# EAGLE design hybrid_lower_pcb3_1 (EAGLE 8.4.1)

## Sheet 1 of 8: micro,xbee,sd
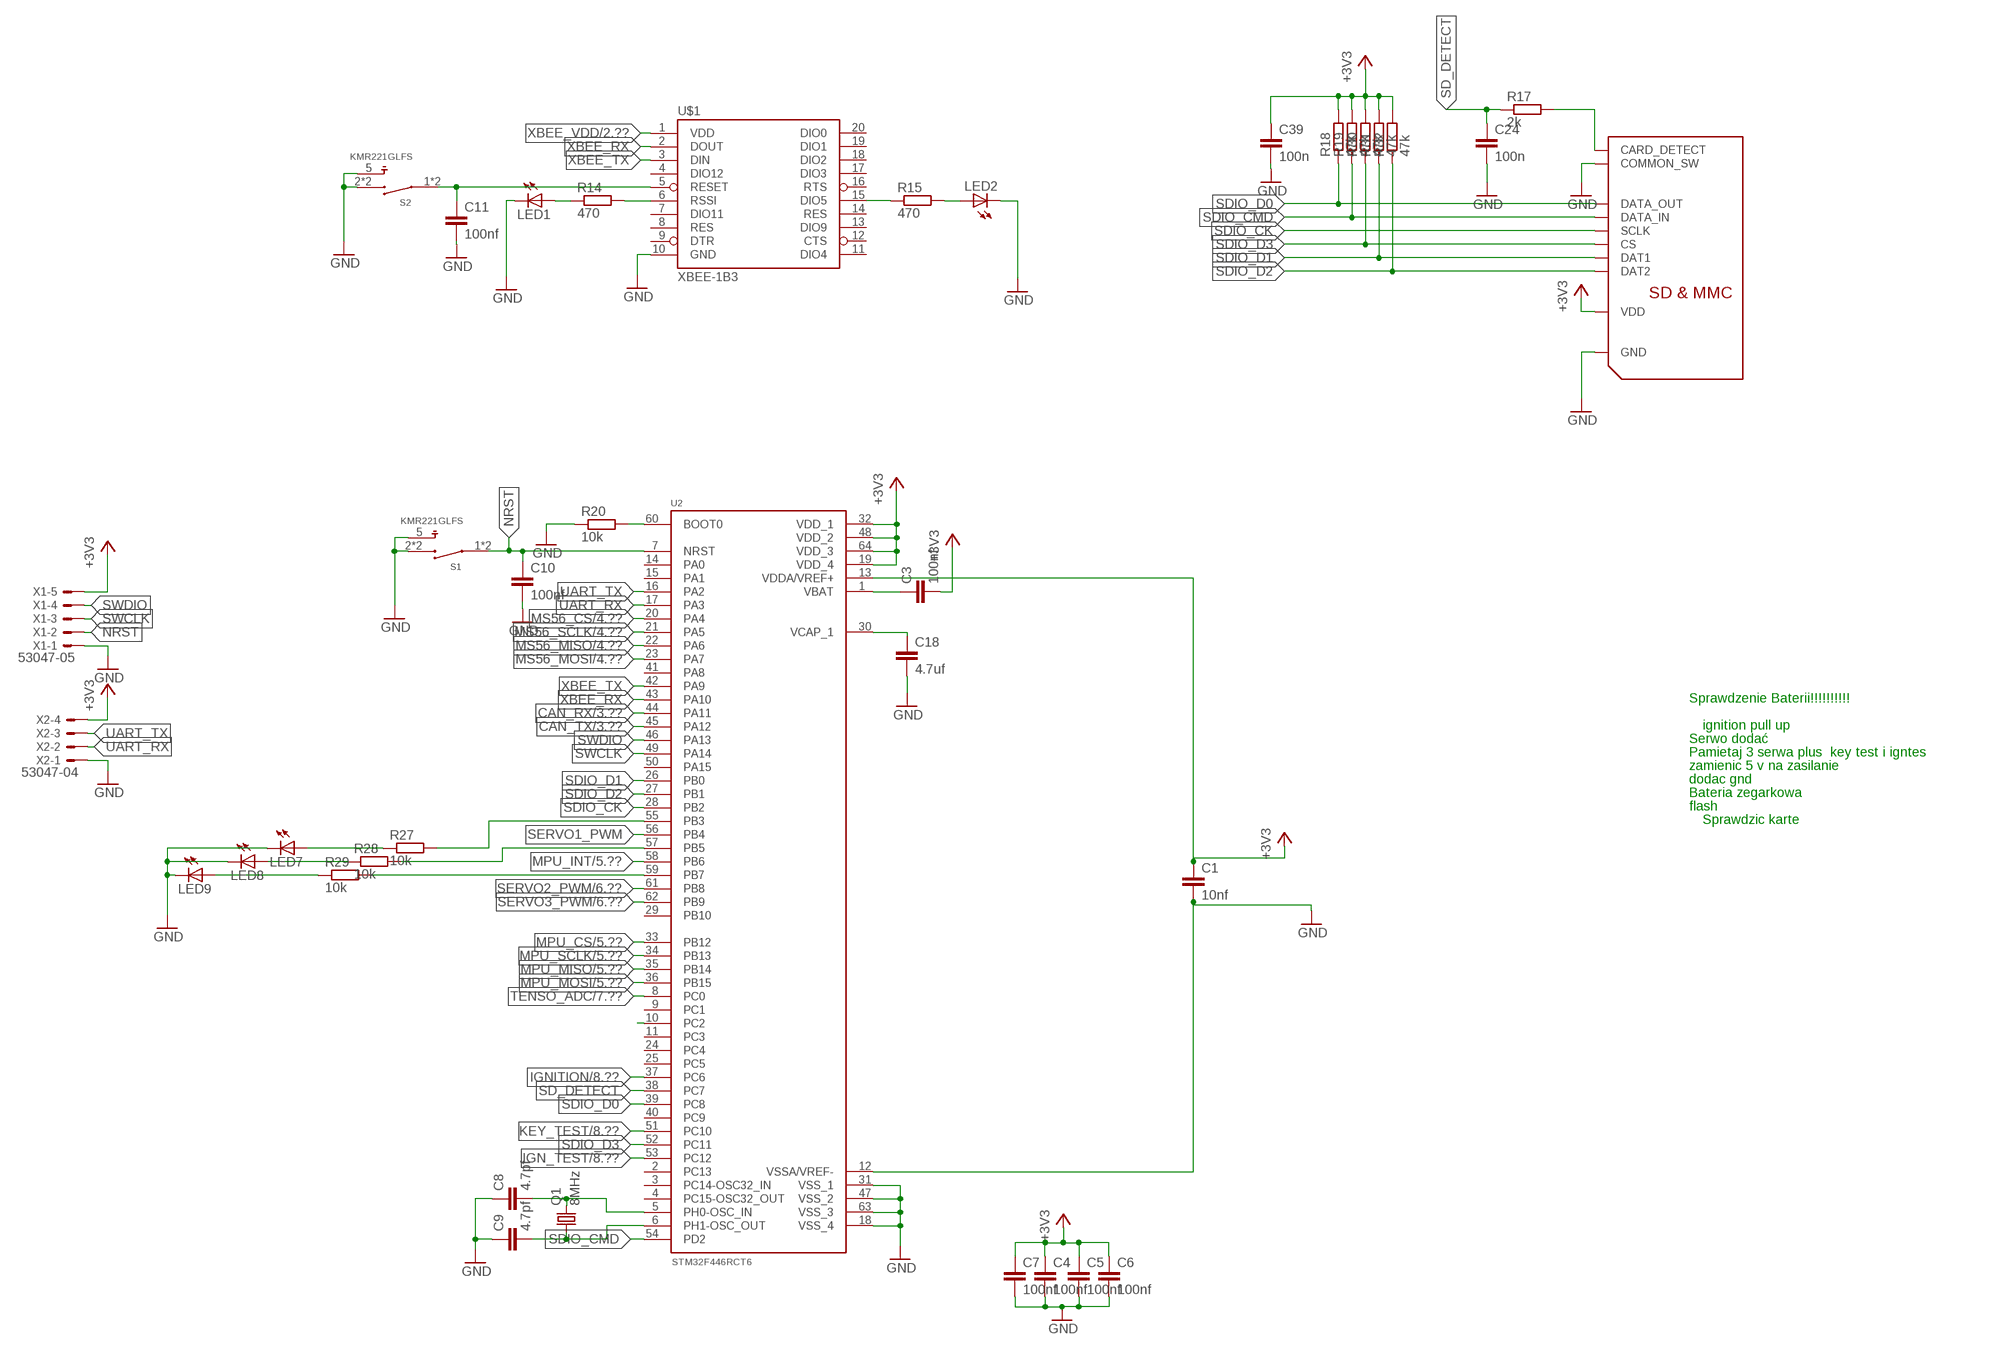
[diagram p0: schematic, sheet 1]

### Parts
C1  10nf  C-EUC0603  [C0603]
C3  100nf  C-EUC0603  [C0603]
C4  100nf  C-EUC0603  [C0603]
C5  100nf  C-EUC0603  [C0603]
C6  100nf  C-EUC0603  [C0603]
C7  100nf  C-EUC0603  [C0603]
C8  4.7pf  C-EUC0603  [C0603]
C9  4.7pf  C-EUC0603  [C0603]
C10  100nf  C-EUC0603  [C0603]
C11  100nf  C-EUC0603  [C0603]
C18  4.7uf  C-EUC0805  [C0805]
C24  100n  C-EUC0603K  [C0603K]
C39  100n  C-EUC0603K  [C0603K]
LED1  LED0603  [LED-0603]
LED2  LED0603  [LED-0603]
LED7  LED0603  [LED-0603]
LED8  LED0603  [LED-0603]
LED9  LED0603  [LED-0603]
Q1  8MHz  CRYSTALCTS406  [CTS406]
R14  470  R-EU_R0603  [R0603]
R15  470  R-EU_R0603  [R0603]
R17  2k  R-EU_R0603  [R0603]
R18  47k  R-EU_R0603  [R0603]
R19  47k  R-EU_R0603  [R0603]
R20  10k  R-EU_R0603  [R0603]
R27  10k  R-EU_R0603  [R0603]
R28  10k  R-EU_R0603  [R0603]
R29  10k  R-EU_R0603  [R0603]
R30  47k  R-EU_R0603  [R0603]
R31  47k  R-EU_R0603  [R0603]
R32  47k  R-EU_R0603  [R0603]
S1  KMR221GLFS  [SW_KMR221GLFS]
S2  KMR221GLFS  [SW_KMR221GLFS]
U2  STM32F446RCT6  [QFP50P1200X1200X160-64N]
U$1  XBEE-1B3  [XBEE-SMD]
U$11  MOLEX_MICRO_SD_503182-1853  [MOLEX_MICRO_SD_503182-1853]
X1  53047-05  [53047-05]
X2  53047-04  [53047-04]

### Nets
+3V3: C1.1 C3.2 C4.1 C5.1 C6.1 C7.1 C39.1 R18.2 R19.2 R30.2 R31.2 R32.2 U2.13(VDDA/VREF+) U2.19(VDD_4) U2.32(VDD_1) U2.48(VDD_2) U2.64(VDD_3) U$11.PIN4(VDD) X1.5 X2.4 ; also sheet 2,3,4,5,8
CAN_RX: U2.44(PA11) ; also sheet 3
CAN_TX: U2.45(PA12) ; also sheet 3
DUPA: C11.1 S2.1 S2.4 U$1.5(RESET)
GND: C1.2 C4.2 C5.2 C6.2 C7.2 C8.1 C9.1 C10.2 C11.2 C18.2 C24.2 C39.2 LED1.C LED2.C LED7.C LED8.C LED9.C R20.1 S1.2 S1.3 S1.5 S2.2 S2.3 S2.5 U2.12(VSSA/VREF-) U2.18(VSS_4) U2.31(VSS_1) U2.47(VSS_2) U2.63(VSS_3) U$1.10(GND) U$11.DETECT_GND(COMMON_SW) U$11.PIN6(GND) X1.1 X2.1 ; also sheet 2,3,4,5,6,7,8
IGN_TEST: U2.53(PC12) ; also sheet 8
IGNITION: U2.37(PC6) ; also sheet 8
KEY_TEST: U2.51(PC10) ; also sheet 8
MPU_CS: U2.33(PB12) ; also sheet 5
MPU_INT: U2.58(PB6) ; also sheet 5
MPU_MISO: U2.35(PB14) ; also sheet 5
MPU_MOSI: U2.36(PB15) ; also sheet 5
MPU_SCLK: U2.34(PB13) ; also sheet 5
MS56_CS: U2.20(PA4) ; also sheet 4
MS56_MISO: U2.22(PA6) ; also sheet 4
MS56_MOSI: U2.23(PA7) ; also sheet 4
MS56_SCLK: U2.21(PA5) ; also sheet 4
N$2: C18.1 U2.30(VCAP_1)
N$6: C3.1 U2.1(VBAT)
N$7: LED1.A R14.1
N$8: C8.2 Q1.3 U2.5(PH0-OSC_IN)
N$9: C9.2 Q1.1 U2.6(PH1-OSC_OUT)
N$11: LED2.A R15.2
N$18: R14.2 U$1.6(RSSI)
N$19: R15.1 U$1.15(DIO5)
N$29: R20.2 U2.60(BOOT0)
N$30: R27.2 U2.55(PB3)
N$33: R28.2 U2.57(PB5)
N$34: R29.2 U2.59(PB7)
N$36: LED7.A R27.1
N$37: LED8.A R28.1
N$38: LED9.A R29.1
N$41: U2.10(PC2)
N$42: R17.2 U$11.DETECT(CARD_DETECT)
NRST: C10.1 S1.1 S1.4 U2.7(NRST) X1.2
SD_DETECT: C24.1 R17.1 U2.38(PC7)
SDIO_CK: U2.28(PB2) U$11.PIN5(SCLK)
SDIO_CMD: R19.1 U2.54(PD2) U$11.PIN3(DATA_IN)
SDIO_D0: R18.1 U2.39(PC8) U$11.PIN7(DATA_OUT)
SDIO_D1: R31.1 U2.26(PB0) U$11.PIN8(DAT1)
SDIO_D2: R32.1 U2.27(PB1) U$11.PIN1(DAT2)
SDIO_D3: R30.1 U2.52(PC11) U$11.PIN2(CS)
SERVO1_PWM: U2.56(PB4)
SERVO2_PWM: U2.61(PB8) ; also sheet 6
SERVO3_PWM: U2.62(PB9) ; also sheet 6
SWCLK: U2.49(PA14) X1.3
SWDIO: U2.46(PA13) X1.4
TENSO_ADC: U2.8(PC0) ; also sheet 7
UART_RX: U2.17(PA3) X2.2
UART_TX: U2.16(PA2) X2.3
XBEE_RX: U2.43(PA10) U$1.2(DOUT)
XBEE_TX: U2.42(PA9) U$1.3(DIN)
XBEE_VDD: U$1.1(VDD) ; also sheet 2
Unconnected: U2.2(PC13) U2.3(PC14-OSC32_IN) U2.4(PC15-OSC32_OUT) U2.9(PC1) U2.11(PC3) U2.14(PA0) U2.15(PA1) U2.24(PC4) U2.25(PC5) U2.29(PB10) U2.40(PC9) U2.41(PA8) U2.50(PA15) U$1.4(DIO12) U$1.7(DIO11) U$1.8(RES) U$1.9(DTR) U$1.11(DIO4) U$1.12(CTS) U$1.13(DIO9) U$1.14(RES) U$1.16(RTS) U$1.17(DIO3) U$1.18(DIO2) U$1.19(DIO1) U$1.20(DIO0)

### Notes on the sheet
- Sprawdzenie Baterii!!!!!!!!!!
- ignition pull up
- Serwo dodać
- Pamietaj 3 serwa plus  key test i igntes
- zamienic 5 v na zasilanie
- dodac gnd
- Bateria zegarkowa
- flash
- Sprawdzic karte

## Sheet 2 of 8: supply
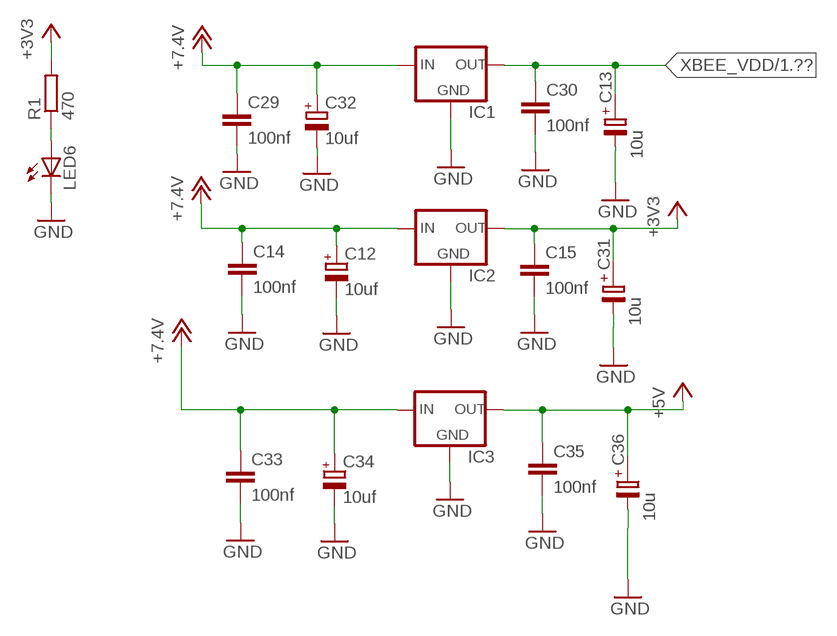
[diagram p1: schematic, sheet 2]

### Parts
C12  10uf  CPOL-EUSANYO_SMD_B6  [SANYO-OSCON_SMD_B6]
C13  10u  C-PR-SMD-TE-B  [TE-B-3528]
C14  100nf  C-EUC0603  [C0603]
C15  100nf  C-EUC0603  [C0603]
C29  100nf  C-EUC0603  [C0603]
C30  100nf  C-EUC0603  [C0603]
C31  10u  C-PR-SMD-TE-B  [TE-B-3528]
C32  10uf  CPOL-EUSANYO_SMD_B6  [SANYO-OSCON_SMD_B6]
C33  100nf  C-EUC0603  [C0603]
C34  10uf  CPOL-EUSANYO_SMD_B6  [SANYO-OSCON_SMD_B6]
C35  100nf  C-EUC0603  [C0603]
C36  10u  C-PR-SMD-TE-B  [TE-B-3528]
IC1  LM1117  [SOT223]
IC2  LM1117  [SOT223]
IC3  LM1117  [SOT223]
LED6  LED0603  [LED-0603]
R1  470  R-EU_R0603  [R0603]

### Nets
+3V3: C15.1 C31.+ IC2.2(OUT) R1.2 ; also sheet 1,3,4,5,8
+5V: C35.1 C36.+ IC3.2(OUT) ; also sheet 6,7
+12V: C12.+ C14.1 C29.1 C32.+ C33.1 C34.+ IC1.3(IN) IC2.3(IN) IC3.3(IN) ; supply symbol labelled +7.4V ; also sheet 6,8
GND: C12.- C13.- C14.2 C15.2 C29.2 C30.2 C31.- C32.- C33.2 C34.- C35.2 C36.- IC1.1(GND) IC2.1(GND) IC3.1(GND) LED6.C ; also sheet 1,3,4,5,6,7,8
N$28: LED6.A R1.1
XBEE_VDD: C13.+ C30.1 IC1.2(OUT) ; also sheet 1

## Sheet 3 of 8: CAN
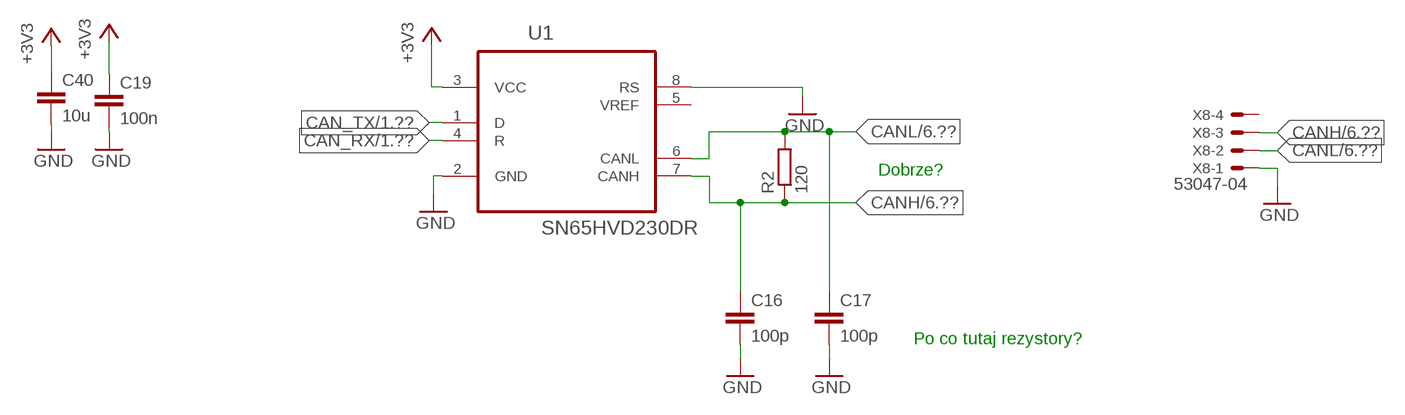
[diagram p2: schematic, sheet 3]

### Parts
C16  100p  C-EUC0603  [C0603]
C17  100p  C-EUC0603  [C0603]
C19  100n  C-EUC0603  [C0603]
C40  10u  C-EUC0805  [C0805]
R2  120  R-EU_R0603  [R0603]
U1  SN65HVD230DR  [SOIC127P600X175-8N]
X8  53047-04  [53047-04]

### Nets
+3V3: C19.1 C40.1 U1.3(VCC) ; also sheet 1,2,4,5,8
CAN_RX: U1.4(R) ; also sheet 1
CAN_TX: U1.1(D) ; also sheet 1
CANH: C16.1 R2.1 U1.7(CANH) X8.3 ; also sheet 6
CANL: C17.1 R2.2 U1.6(CANL) X8.2 ; also sheet 6
GND: C16.2 C17.2 C19.2 C40.2 U1.2(GND) U1.8(RS) X8.1 ; also sheet 1,2,4,5,6,7,8
Unconnected: U1.5(VREF) X8.4

### Notes on the sheet
- Dobrze?
- Po co tutaj rezystory?

## Sheet 4 of 8: Altimeter
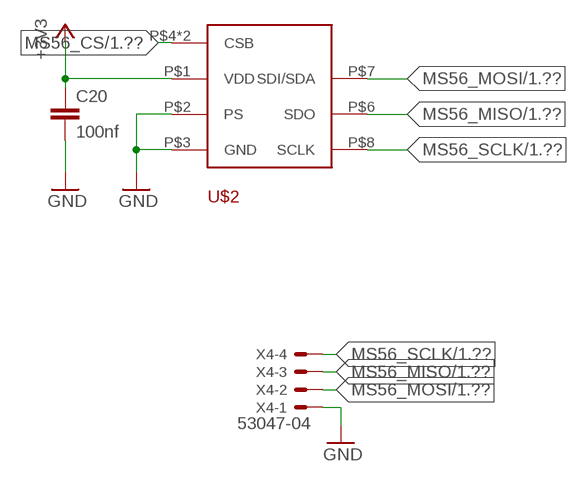
[diagram p3: schematic, sheet 4]

### Parts
C20  100nf  C-EUC0603  [C0603]
U$2  MS56XX  [MS56XX]
X4  53047-04  [53047-04]

### Nets
+3V3: C20.1 U$2.P$1(VDD) ; also sheet 1,2,3,5,8
GND: C20.2 U$2.P$2(PS) U$2.P$3(GND) X4.1 ; also sheet 1,2,3,5,6,7,8
MS56_CS: U$2.P$4(CSB) U$2.P$5(CSB) ; also sheet 1
MS56_MISO: U$2.P$6(SDO) X4.3 ; also sheet 1
MS56_MOSI: U$2.P$7(SDI/SDA) X4.2 ; also sheet 1
MS56_SCLK: U$2.P$8(SCLK) X4.4 ; also sheet 1

## Sheet 5 of 8: MPU-9250
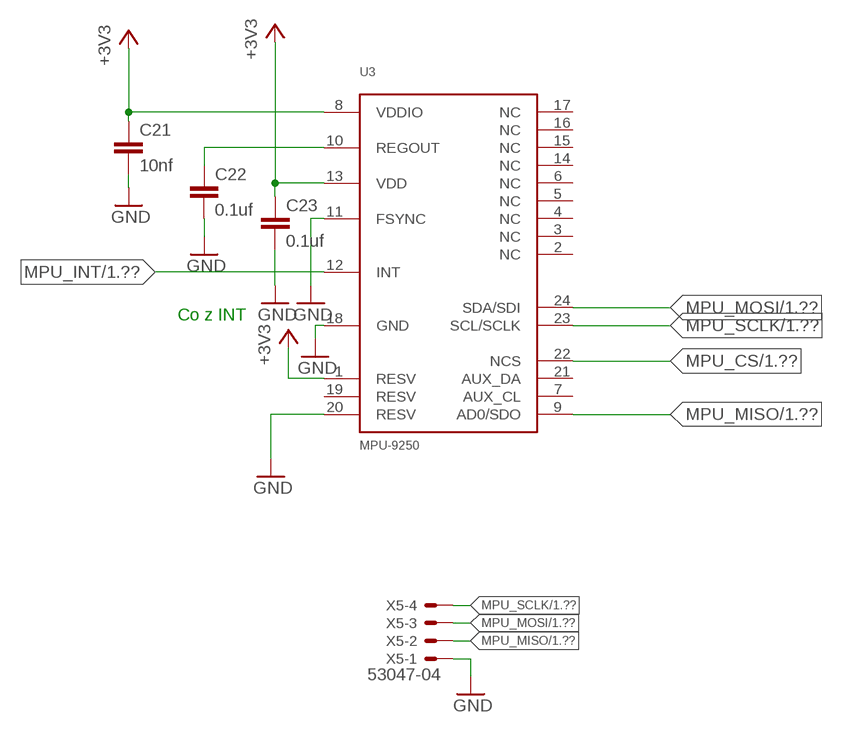
[diagram p4: schematic, sheet 5]

### Parts
C21  10nf  C-EUC0603  [C0603]
C22  0.1uf  C-EUC0603  [C0603]
C23  0.1uf  C-EUC0603  [C0603]
U3  MPU-9250  [MPU-9250]
X5  53047-04  [53047-04]

### Nets
+3V3: C21.1 C23.1 U3.1(RESV) U3.8(VDDIO) U3.13(VDD) ; also sheet 1,2,3,4,8
GND: C21.2 C22.2 C23.2 U3.11(FSYNC) U3.18(GND) U3.20(RESV) X5.1 ; also sheet 1,2,3,4,6,7,8
MPU_CS: U3.22(NCS) ; also sheet 1
MPU_INT: U3.12(INT) ; also sheet 1
MPU_MISO: U3.9(AD0/SDO) X5.2 ; also sheet 1
MPU_MOSI: U3.24(SDA/SDI) X5.3 ; also sheet 1
MPU_SCLK: U3.23(SCL/SCLK) X5.4 ; also sheet 1
N$1: C22.1 U3.10(REGOUT)
Unconnected: U3.2(NC) U3.3(NC) U3.4(NC) U3.5(NC) U3.6(NC) U3.7(AUX_CL) U3.14(NC) U3.15(NC) U3.16(NC) U3.17(NC) U3.19(RESV) U3.21(AUX_DA)

### Notes on the sheet
- Co z INT

## Sheet 6 of 8: connection
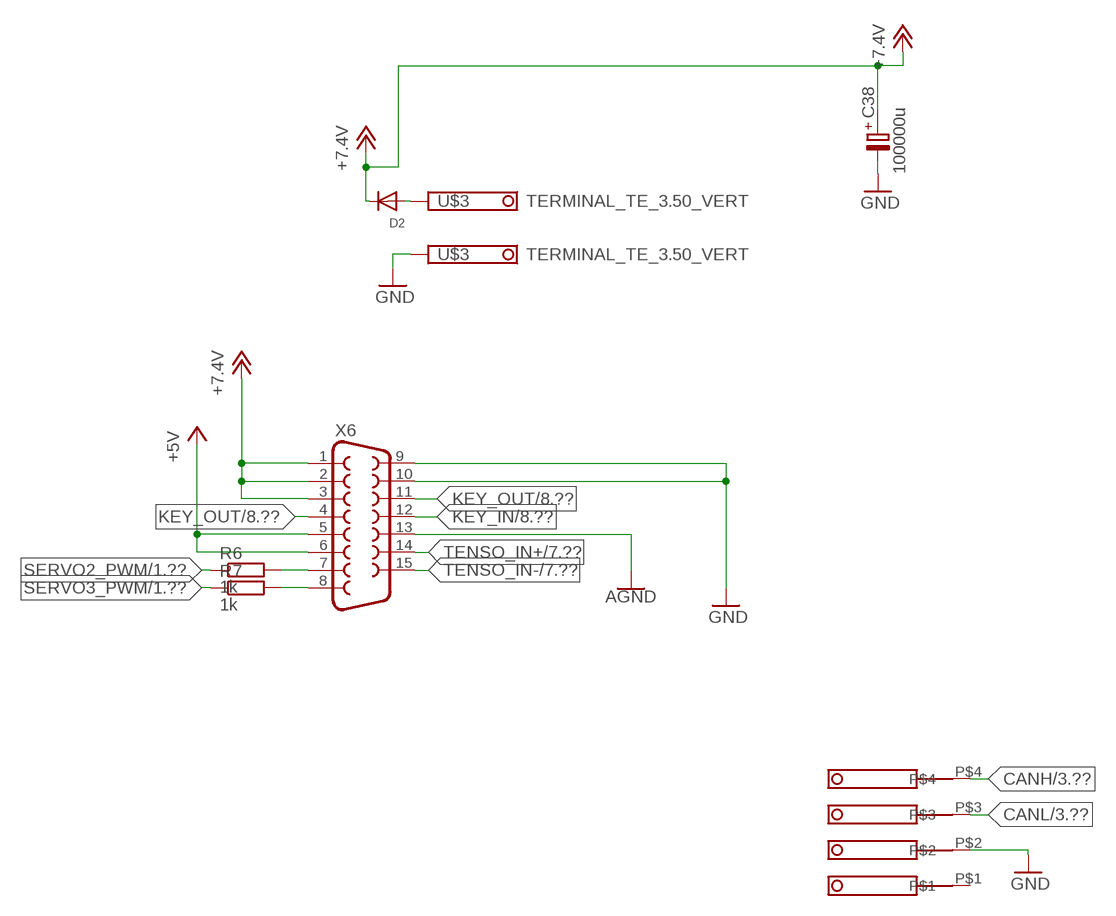
[diagram p5: schematic, sheet 6]

### Parts
C38  100000u  C-PR-SMD-TE-B  [TE-B-3528]
D2  DIODESOD-523  [SOD-523]
R6  1k  R-EU_R0603  [R0603]
R7  1k  R-EU_R0603  [R0603]
U$3  TERMINAL_TE_3.50_VERT  [TE_3.5_TERMINAL_VERT]
U$10  39505-1005  [39505-1005]
X6  F15VP  [F15VP]

### Nets
+5V: X6.5 X6.6 ; also sheet 2,7
+12V: C38.+ D2.K(C) X6.1 X6.2 X6.3 ; supply symbol labelled +7.4V ; also sheet 2,8
AGND: X6.13 ; also sheet 7
CANH: U$10.P$4 ; also sheet 3
CANL: U$10.P$3 ; also sheet 3
GND: C38.- U$3.P$2(K1) U$10.P$2 X6.9 X6.10 ; also sheet 1,2,3,4,5,7,8
KEY_IN: X6.12 ; also sheet 8
KEY_OUT: X6.4 X6.11 ; also sheet 8
N$13: R6.2 X6.7
N$14: R7.2 X6.8
N$17: D2.A U$3.P$1(K)
SERVO2_PWM: R6.1 ; also sheet 1
SERVO3_PWM: R7.1 ; also sheet 1
TENSO_IN+: X6.14 ; also sheet 7
TENSO_IN-: X6.15 ; also sheet 7
Unconnected: U$10.P$1

## Sheet 7 of 8
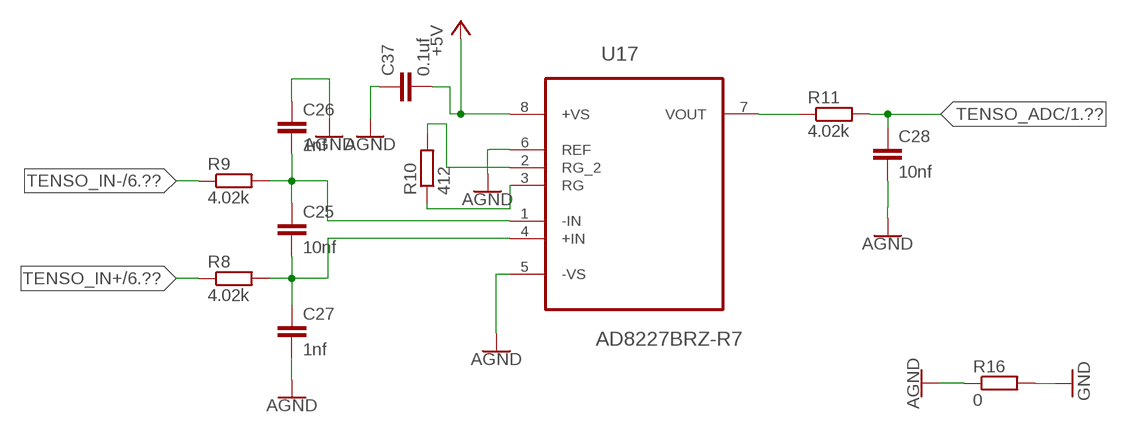
[diagram p6: schematic, sheet 7]

### Parts
C25  10nf  C-EUC0603  [C0603]
C26  1nf  C-EUC0603  [C0603]
C27  1nf  C-EUC0603  [C0603]
C28  10nf  C-EUC0603  [C0603]
C37  0.1uf  C-EUC0603  [C0603]
R8  4.02k  R-EU_R0603  [R0603]
R9  4.02k  R-EU_R0603  [R0603]
R10  412  R-EU_R0805  [R0805]
R11  4.02k  R-EU_R0603  [R0603]
R16  0  R-EU_R0603  [R0603]
U17  AD8227BRZ-R7  [SOIC127P600X175-8N]

### Nets
+5V: C37.2 U17.8(+VS) ; also sheet 2,6
AGND: C26.1 C27.2 C28.2 C37.1 R16.1 U17.5(-VS) U17.6(REF) ; also sheet 6
GND: R16.2 ; also sheet 1,2,3,4,5,6,8
N$3: C25.1 C26.2 R9.2 U17.1(-IN)
N$4: C25.2 C27.1 R8.2 U17.4(+IN)
N$10: R10.1 U17.3(RG)
N$15: R10.2 U17.2(RG_2)
N$16: R11.1 U17.7(VOUT)
TENSO_ADC: C28.1 R11.2 ; also sheet 1
TENSO_IN+: R8.1 ; also sheet 6
TENSO_IN-: R9.1 ; also sheet 6

## Sheet 8 of 8: Ignition
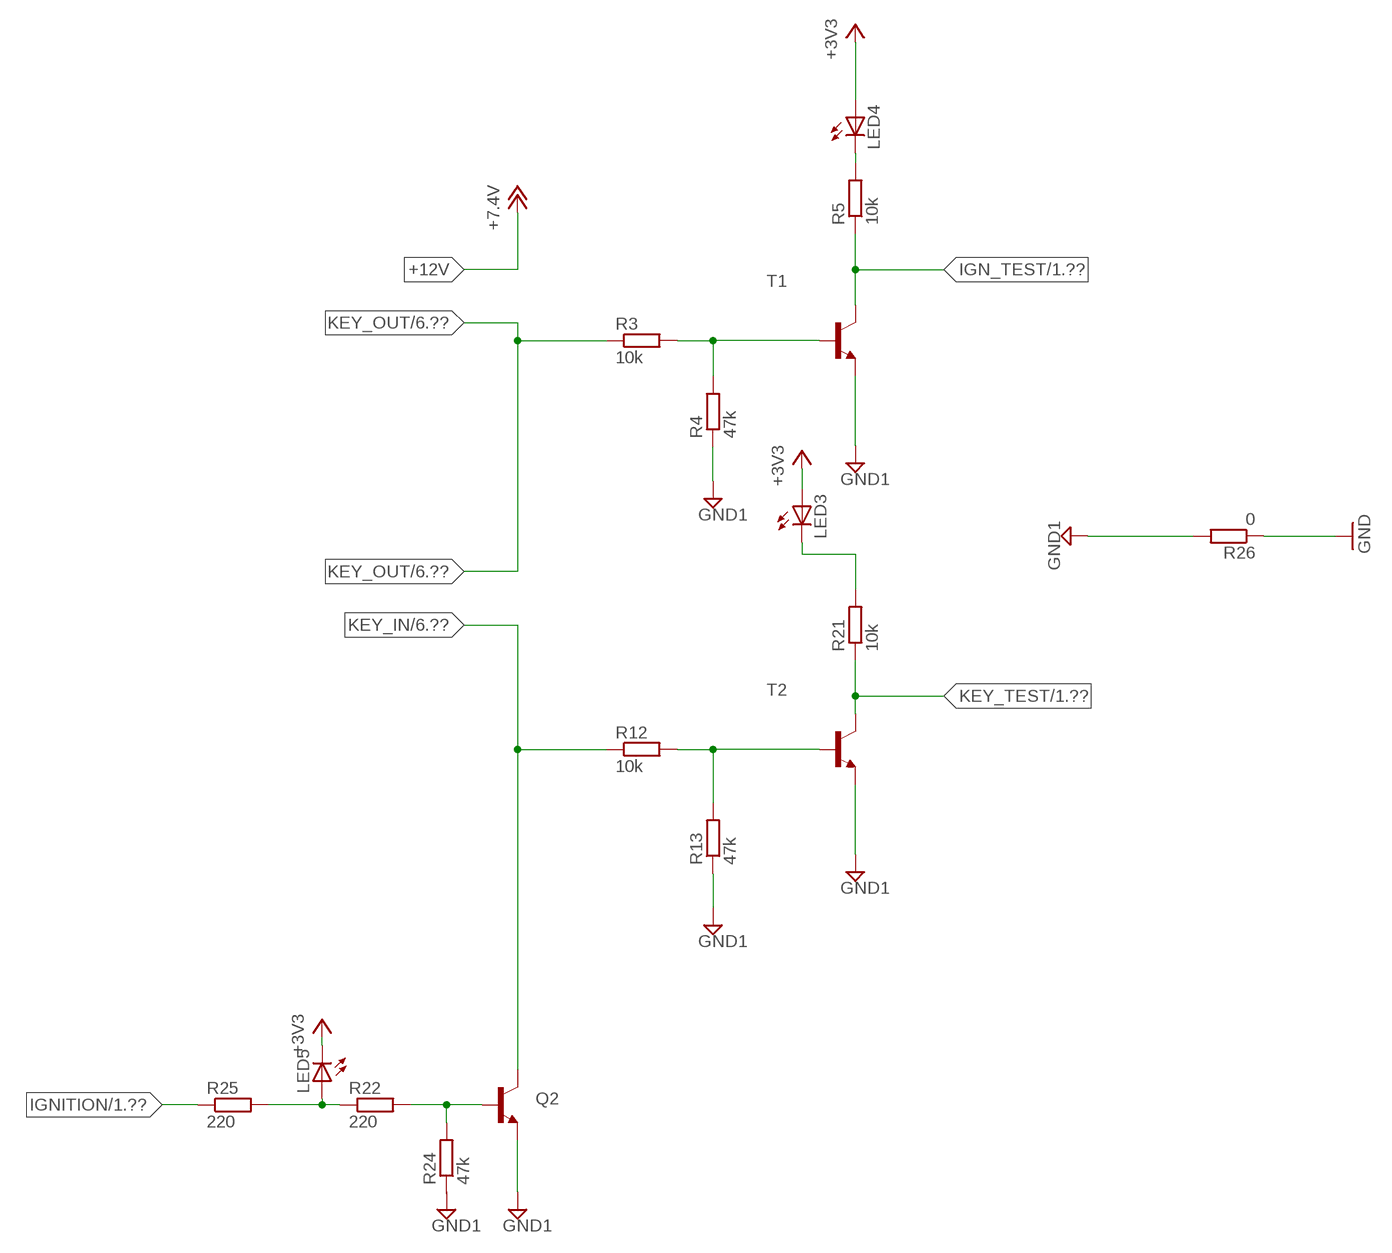
[diagram p7: schematic, sheet 8]

### Parts
LED3  LED0603  [LED-0603]
LED4  LED0603  [LED-0603]
LED5  LED0603  [LED-0603]
Q2  TRANSISTOR_NPNSOT23-3  [SOT23-3]
R3  10k  R-EU_R0603  [R0603]
R4  47k  R-EU_R0603  [R0603]
R5  10k  R-EU_R0603  [R0603]
R12  10k  R-EU_R0603  [R0603]
R13  47k  R-EU_R0603  [R0603]
R21  10k  R-EU_R0603  [R0603]
R22  220  R-EU_R0603  [R0603]
R24  47k  R-EU_R0603  [R0603]
R25  220  R-EU_R0603  [R0603]
R26  0  R-EU_R0603  [R0603]
T1  BCW81-NPN-SOT23-BEC  [SOT23-BEC]
T2  BCW81-NPN-SOT23-BEC  [SOT23-BEC]

### Nets
+3V3: LED3.A LED4.A LED5.C ; also sheet 1,2,3,4,5
GND: R26.1 ; also sheet 1,2,3,4,5,6,7
GND1: Q2.2(E) R4.1 R13.1 R26.2 T1.E T2.E
IGN_TEST: R5.1 T1.C ; also sheet 1
IGNITION: R25.1 ; also sheet 1
KEY_IN: Q2.3(C) R12.1 ; also sheet 6
KEY_OUT: R3.1 ; also sheet 6
KEY_TEST: R21.1 T2.C ; also sheet 1
N$5: R3.2 R4.2 T1.B
N$12: R12.2 R13.2 T2.B
N$20: LED4.C R5.2
N$21: LED3.C R21.2
N$31: Q2.1(B) R22.2 R24.2
N$35: LED5.A R22.1 R25.2
Unconnected: R24.1

## Library data of the parts
C1 C3-C11 C14-C17 C19 C21-C30 C33 C35 C37 C39 C40 = rcl:C-EU: CAPACITOR, European symbol
C12 C32 C34 = rcl:CPOL-EU: POLARIZED CAPACITOR, European symbol; SPICEPREFIX: C
C13 C31 C36 C38 = capacitors:C-PR: POLARIZED ELECTROLYTIC/TANTALUM
C18 = rcl:C-EU: CAPACITOR, European symbol; SPICEPREFIX: C
C20 = resistor:C-EU: CAPACITOR, European symbol
D2 = adafruit:DIODE: Diode SMADIODE - SMA Surface Mount Package 20V 1A Schottky Diode Digikey: 641-1014-6-ND DO-1N4148 - Through Hole Small Current Diode SOD-123 20V 1 A (.5mV Vf) Schottky Diode - Digikey: MBRX120TPMSCT-ND SOD-323 10V 570mA (.38mV Vf, 3ns) Schottky Diode - Digikey: ZLLS410CT-ND SOD-523 30V 30mA Schottky Diode (RB751S-40TE61) - Digikey: RB751S-40TE61CT-ND SOT23-R/W - SOT23 Package (R = Solder Paste/Reflow Ovens, W = Hand-Soldering) BAT54Film 40V 300mA - Digikey: 497-7162-1-ND
IC1-IC3 = v-reg-3:LM1117
LED1-LED9 = SparkFun:LED: LEDs Standard schematic elements and footprints for 5mm, 3mm, 1206, and 0603 sized LEDs. 5mm - Spark Fun Electronics SKU : COM-00529 (and others)
Q1 = crystal:CRYSTAL: CRYSTAL; OC_FARNELL: unknown; OC_NEWARK: unknown
Q2 = SparkFun:TRANSISTOR_NPN: Transistor NPN BJT configuration in SOT23 package. MMBT2222 is the common NPN we use. Double check BCE configuration again layout.
R1 R16 R20 R27-R29 = resistor:R-EU_: RESISTOR, European symbol
R2-R15 R17-R19 R21 R22 R24-R26 R30-R32 = rcl:R-EU_: RESISTOR, European symbol
S1 S2 = KMR221GLFS:KMR221GLFS: Switch Tactile N.O. SPST Button Gull Wing 0.05A 32VDC 1VA 200000Cycles 2N SMD Automotive T/R; AVAILABILITY: Good; DESCRIPTION: Switch Tactile N.O. SPST Button Gull Wing 0.05A 32VDC 1VA 200000Cycles 2N SMD Automotive T/R; MF: C&K Components; MP: KMR221GLFS; PACKAGE: None; PRICE: 0.28 USD
T1 T2 = DC_LOAD_AU:*-NPN-: NPN Transistror BF959 corrected 2008.03.06
U1 = SN65HVD230DR:SN65HVD230DR: 3.3-V CAN TRANSCEIVERS; AVAILABILITY: Good; DESCRIPTION: 3.3V CAN Transceiver with Standby Mode 8-SOIC -40 to 85; MF: Texas Instruments; MP: SN65HVD230DR; PACKAGE: SOIC-8 Texas Instruments; PRICE: 1.59 USD
U2 = STM32F446RCT6:STM32F446RCT6: 32 Bit Microcontroller, High Performance, ARM Cortex-M4, 180 MHz, 256 KB, 128 KB, 64, LQFP; AVAILABILITY: Good; DESCRIPTION: 32 Bit Microcontroller, High Performance, ARM Cortex-M4, 180 MHz, 256 KB, 128 KB, 64, LQFP; MF: STMicroelectronics; MP: STM32F446RCT6; PACKAGE: LQFP-64 STMicroelectronics; PRICE: 5.57 USD
U3 = MPU-9250:MPU-9250: 314990005; AVAILABILITY: Good; DESCRIPTION: SMD Gyroscope/Accelerometer/Magnetometer Sensor; 9-AXIS; MF: InvenSense; MP: MPU-9250; PACKAGE: QFN-24 InvenSense; PRICE: 6.45 USD
U17 = Analog Devices_By_element14_Batch_1:AD8227BRZ-R7: Wide Supply Range, Rail-to-Rail Output Instrumentation Amplifier; MPN: AD8227BRZ-R7; OC_FARNELL: -; OC_NEWARK: 14R8723; PACKAGE: SOIC-8; SUPPLIER: Analog Devices
U$1 = SparkFun:XBEE-1
U$2 = MS56XX:MS56XX
U$3 = Terminal_TE_3.50:TERMINAL_TE_3.50_VERT
U$10 = 39505-1005:39505-1005
U$11 = SD_Reader:MOLEX_MICRO_SD_503182-1853
X1 = con-molex:53?-05: CONNECTOR wire to board 1.25 mm (.049 inch) pitch header; MF: MOLEX; MPN: 53047-0510; OC_FARNELL: 9732861; OC_NEWARK: 38C9901
X2 X4 X5 X8 = con-molex:53?-04: CONNECTOR wire to board 1.25 mm (.049 inch) pitch header; MF: WALDOM/MOLEX; MPN: 53047-0410; OC_FARNELL: 9733060; OC_NEWARK: 38C9900
X6 = adafruit:F15: SUB-D HDH is also known as a 'right angle VGA' connector

## Board
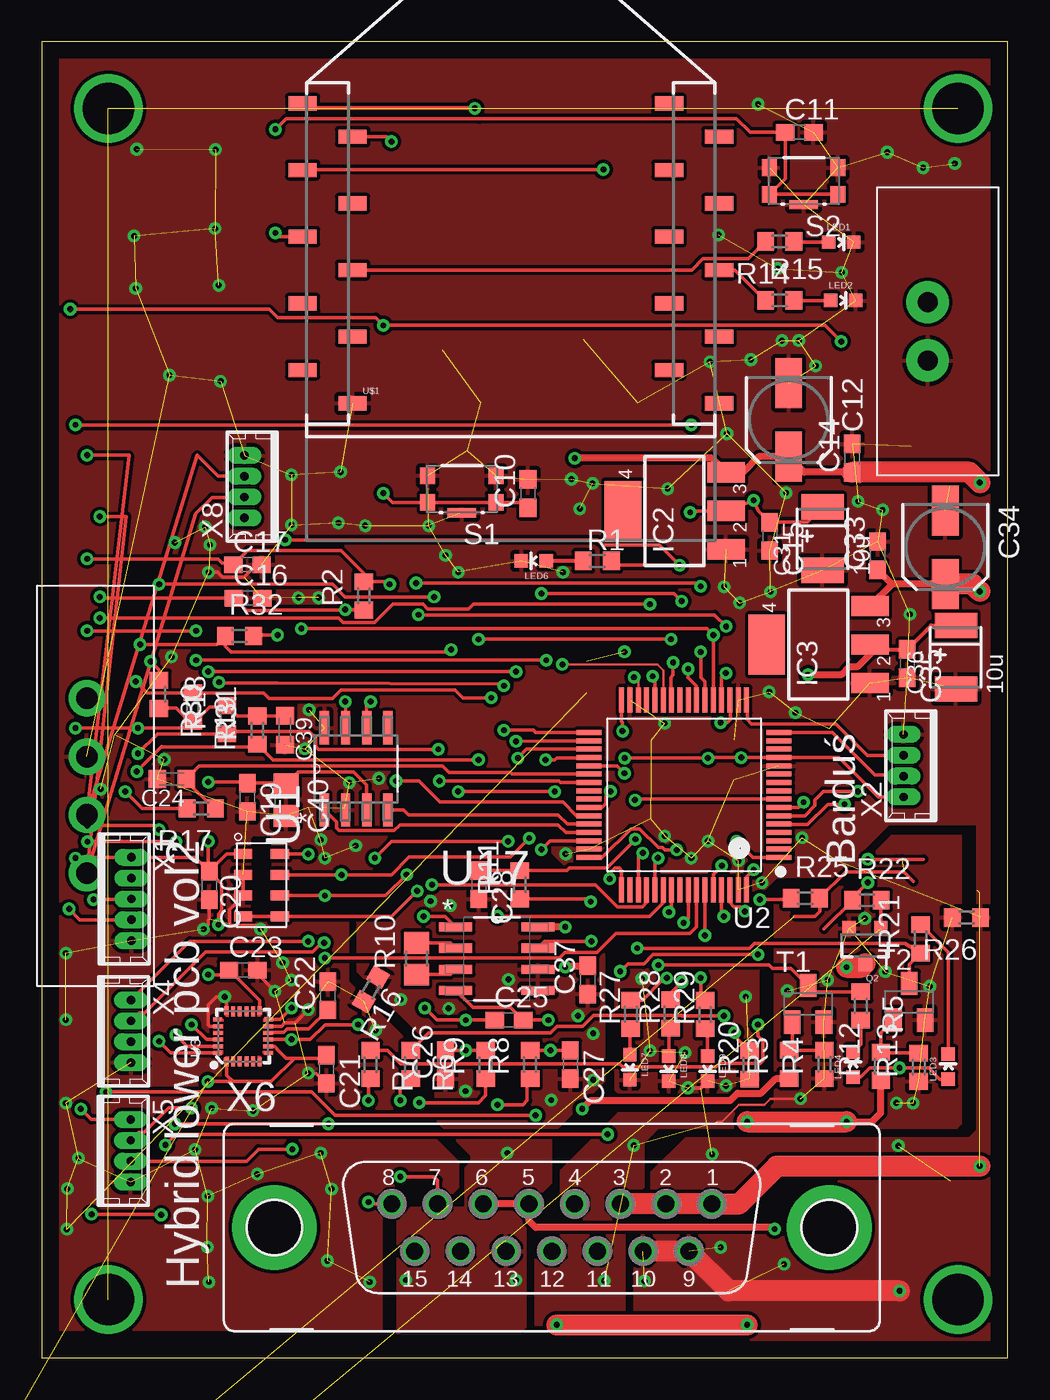
[diagram p8: board, top side]
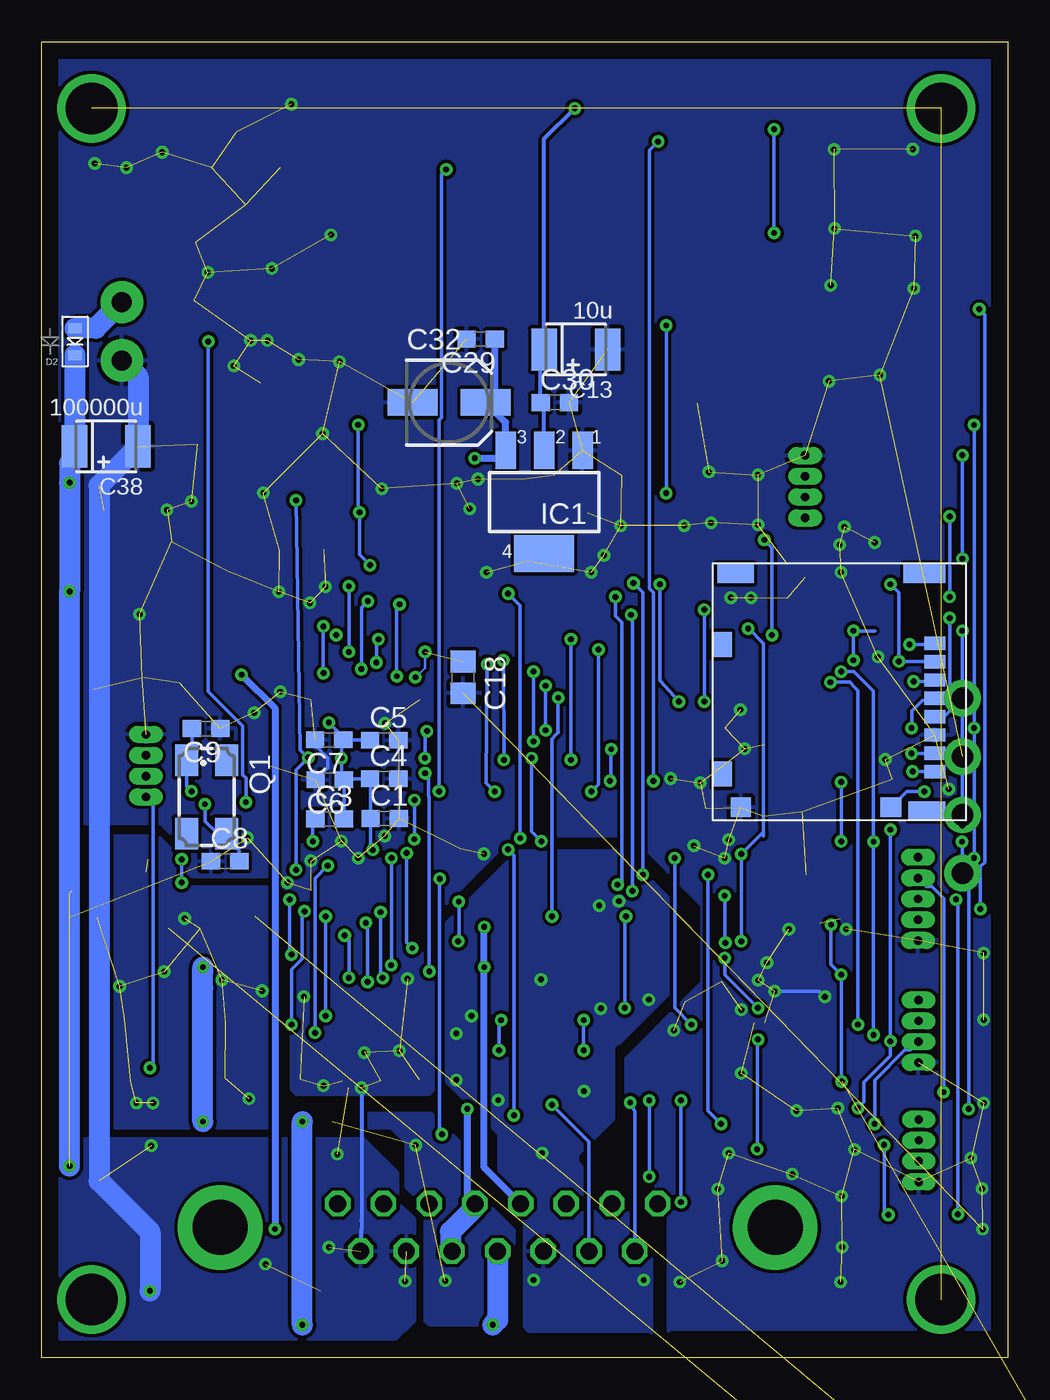
[diagram p9: board, bottom side, seen from below]

Size 58 x 79 mm. Coordinates in mm from the lower left corner, seen from the top.
Outline: 0,0 58,0 58,79 0,79 0,0
Copper layers (1*16): Top 0.035mm / dielectric 1.5mm / Bottom 0.035mm
Design rules "default *": minimum track width 6mil, minimum drill 0.35mm, track to track 6mil, track to pad 6mil, pad to pad 6mil, via to via 6mil, smd to smd 6mil, copper to edge 40mil, drill to drill 6mil, minimum pad ring 10mil, minimum via ring 8mil, stop-mask expansion 4mil, vias tented up to drill 15mil, thermal gap 10mil
tRestrict: area 12.8,27 to 13.6,31.1

### Footprints (pad centres in the part's own frame; a part is rotated, then mirrored left to right if it is on the bottom)
C0603 = smd 1.1 x 1: 1 -0.85,0; 2 0.85,0
SANYO-OSCON_SMD_B6 = smd 3 x 1.6: + 2.2,0; - -2.2,0
TE-B-3528 = smd 1.524 x 2.54: + 1.905,0; - -1.905,0
C0805 = smd 1.3 x 1.5: 1 -0.95,0; 2 0.95,0
C0603K = smd 1.05 x 1.08: 1 -0.875,0; 2 0.875,0
SOD-523 = smd 0.8 x 0.6: A 0,-0.8; K 0,0.8
SOT223 = smd 1.219 x 2.235: 1 -2.311,-3.099; 2 0,-3.099; 3 2.311,-3.099 | smd 3.6 x 2.2: 4 0,3.099
LED-0603 = smd 0.8 x 0.8: A 0,-0.75; C 0,0.75
CTS406 = smd 1.9 x 1.4: 1 -2.2,-1.2; 2 2.2,-1.2; 3 2.2,1.2; 4 -2.2,1.2
SOT23-3 = smd 0.8 x 0.9: 1 -0.95,-1; 2 0.95,-1; 3 0,1.1
R0603 = smd 1 x 1.1: 1 -0.85,0; 2 0.85,0
R0805 = smd 1.3 x 1.5: 1 -0.95,0; 2 0.95,0
SW_KMR221GLFS = smd 0.9 x 1: 1 -2.05,0.8; 2 -2.05,-0.8; 3 2.05,-0.8; 4 2.05,0.8 | smd 1.7 x 0.55: 5 0,1.425
SOT23-BEC = smd 1 x 1.4: B -0.95,-1.1; C 0,1.1; E 0.95,-1.1
SOIC127P600X175-8N = smd 1.981 x 0.559: 1 -2.464,1.905; 2 -2.464,0.635; 3 -2.464,-0.635; 4 -2.464,-1.905; 5 2.464,-1.905; 6 2.464,-0.635; 7 2.464,0.635; 8 2.464,1.905
QFP50P1200X1200X160-64N = smd 1.5 x 0.3: 1 -5.7,3.75; 2 -5.7,3.25; 3 -5.7,2.75; 4 -5.7,2.25; 5 -5.7,1.75; 6 -5.7,1.25; 7 -5.7,0.75; 8 -5.7,0.25; 9 -5.7,-0.25; 10 -5.7,-0.75; 11 -5.7,-1.25; 12 -5.7,-1.75; 13 -5.7,-2.25; 14 -5.7,-2.75; 15 -5.7,-3.25; 16 -5.7,-3.75; 33 5.7,-3.75; 34 5.7,-3.25; 35 5.7,-2.75; 36 5.7,-2.25; 37 5.7,-1.75; 38 5.7,-1.25; 39 5.7,-0.75; 40 5.7,-0.25; 41 5.7,0.25; 42 5.7,0.75; 43 5.7,1.25; 44 5.7,1.75; 45 5.7,2.25; 46 5.7,2.75; 47 5.7,3.25; 48 5.7,3.75 | smd 0.3 x 1.5: 17 -3.75,-5.7; 18 -3.25,-5.7; 19 -2.75,-5.7; 20 -2.25,-5.7; 21 -1.75,-5.7; 22 -1.25,-5.7; 23 -0.75,-5.7; 24 -0.25,-5.7; 25 0.25,-5.7; 26 0.75,-5.7; 27 1.25,-5.7; 28 1.75,-5.7; 29 2.25,-5.7; 30 2.75,-5.7; 31 3.25,-5.7; 32 3.75,-5.7; 49 3.75,5.7; 50 3.25,5.7; 51 2.75,5.7; 52 2.25,5.7; 53 1.75,5.7; 54 1.25,5.7; 55 0.75,5.7; 56 0.25,5.7; 57 -0.25,5.7; 58 -0.75,5.7; 59 -1.25,5.7; 60 -1.75,5.7; 61 -2.25,5.7; 62 -2.75,5.7; 63 -3.25,5.7; 64 -3.75,5.7
MPU-9250 = smd 0.495 x 0.25: 1 -1.552,1; 6 -1.552,-1; 13 1.552,-1; 18 1.552,1 | smd 0.6 x 0.24: 2 -1.5,0.6; 3 -1.5,0.2; 4 -1.5,-0.2; 5 -1.5,-0.6; 14 1.5,-0.6; 15 1.5,-0.2; 16 1.5,0.2; 17 1.5,0.6 | smd 0.25 x 0.495: 7 -1,-1.552; 12 1,-1.552; 19 1,1.552; 24 -1,1.552 | smd 0.24 x 0.6: 8 -0.6,-1.5; 9 -0.2,-1.5; 10 0.2,-1.5; 11 0.6,-1.5; 20 0.6,1.5; 21 0.2,1.5; 22 -0.2,1.5; 23 -0.6,1.5
XBEE-SMD = smd 1.7 x 0.85: 1 -12.5,20; 2 -9.5,18; 3 -12.5,16; 4 -9.5,14; 5 -12.5,12; 6 -9.5,10; 7 -12.5,8; 8 -9.5,6; 9 -12.5,4; 10 -9.5,2; 11 12.5,2; 12 9.5,4; 13 12.5,6; 14 9.5,8; 15 12.5,10; 16 9.5,12; 17 12.5,14; 18 9.5,16; 19 12.5,18; 20 9.5,20
MS56XX = smd 1.1 x 0.6: P$1 -1.1,1.875; P$2 -1.1,0.625; P$3 -1.1,-0.625; P$4 -1.1,-1.875; P$5 1.1,-1.875; P$6 1.1,-0.625; P$7 1.1,0.625; P$8 1.1,1.875
TE_3.5_TERMINAL_VERT = drill 1.2 pad 2.54: P$1 1.75,-3; P$2 -1.75,-3
39505-1005 = drill 1.3 pad 2.184: P$1 -5.41,3.46; P$2 -1.91,3.46; P$3 1.59,3.46; P$4 5.09,3.46
MOLEX_MICRO_SD_503182-1853 = smd 1.16 x 1.25: DETECT 14.66,10.7 | smd 1.16 x 1.2: DETECT_GND 14.66,1.7 | smd 1.15 x 2.5: P$9 0.635,12.7 | smd 1.15 x 2.2: P$10 0.625,1.37 | smd 1.5 x 1.15: P$11 4.88,0.575; P$12 12.66,0.575 | smd 1.12 x 2.2: P$15 14.865,12.85 | smd 0.8 x 1.24: PIN1 4.82,13.33; PIN2 5.92,13.33; PIN3 7.02,13.33; PIN4 8.12,13.33; PIN5 9.22,13.33; PIN6 10.32,13.33; PIN7 11.42,13.33; PIN8 12.52,13.33
53047-05 = drill 0.5 pad 0.698 long: 1 2.5,0.45; 2 1.25,0.45; 3 0,0.45; 4 -1.25,0.45; 5 -2.5,0.45
53047-04 = drill 0.5 pad 0.698 long: 1 1.875,0.45; 2 0.625,0.45; 3 -0.625,0.45; 4 -1.875,0.45
F15VP = drill 1.016 octagon: 1 9.601,1.422; 2 6.858,1.422; 3 4.115,1.422; 4 1.372,1.422; 5 -1.372,1.422; 6 -4.115,1.422; 7 -6.858,1.422; 8 -9.601,1.422; 9 8.23,-1.422; 10 5.486,-1.422; 11 2.743,-1.422; 12 0,-1.422; 13 -2.743,-1.422; 14 -5.486,-1.422; 15 -8.23,-1.422 | drill 3.302 pad 5.08: G1 -16.662,0; G2 16.662,0

### Placement (x,y rotation side)
C1  37.41,32.38 0 bottom
C3  40.72,32.35 0 bottom
C4  37.43,34.76 0 bottom
C5  37.43,37.06 0 bottom
C6  40.7,34.69 180 bottom
C7  40.73,37.1 180 bottom
C8  46.98,29.8 0 bottom
C9  48.12,37.77 180 bottom
C10  29.19,51.88 90 top
C11  45.49,73.56 0 top
C12  44.85,56.29 270 top
C13  25.93,60.52 180 bottom
C14  48.66,54.01 90 top
C15  43.7,49.31 270 top
C16  12.39,45.59 0 top
C17  12.36,47.61 0 top
C18  32.7,40.85 270 bottom
C19  12.35,33.64 270 top
C20  10.06,28.36 270 top
C21  17.09,17.33 270 top
C22  17.19,21.73 90 top
C23  12.11,23.28 0 top
C24  7.81,34.75 180 top
C25  28.05,20.27 0 top
C26  24.24,17.61 90 top
C27  31.73,17.61 270 top
C28  26.24,28.4 270 top
C29  31.64,61.15 180 bottom
C30  27.2,57.34 0 bottom
C31  46.88,49.16 90 top
C32  33.55,57.34 0 bottom
C33  50.18,48.15 90 top
C34  54.24,48.66 270 top
C35  51.96,41.67 270 top
C36  54.88,42.05 90 top
C37  32.78,22.68 90 top
C38  54.12,54.7 180 bottom
C39  14.6,37.67 270 top
C40  14.67,33.48 270 top
D2  56,61 180 bottom
IC1  27.84,51.37 180 bottom
IC2  37.99,50.83 90 top
IC3  46.62,42.81 90 top
LED1  48,66.97 270 top
LED2  48.11,63.47 270 top
LED3  54.42,17.48 0 top
LED4  48.7,17.61 0 top
LED5  -9.97,-18.84 0 top  (outside the outline)
LED6  29.55,47.83 90 top
LED7  35.31,17.45 180 top
LED8  37.64,17.37 180 top
LED9  39.98,17.37 180 top
Q1  48.09,33.66 270 bottom
Q2  49.43,24.76 180 top
R1  33.36,47.83 0 top
R2  19.34,45.74 90 top
R3  44.87,17.62 90 top
R4  46.98,17.62 90 top
R5  49.17,21.13 270 top
R6  22.16,17.61 270 top
R7  19.75,17.61 270 top
R8  29.32,17.61 90 top
R9  26.65,17.61 90 top
R10  22.5,23.95 90 top
R11  28.7,28.4 90 top
R12  50.37,17.5 90 top
R13  52.65,17.45 90 top
R14  44.3,67.01 180 top
R15  44.3,63.47 0 top
R16  19.77,22.12 240 top
R17  9.59,32.97 180 top
R18  11.11,38.31 90 top
R19  9.08,39.07 270 top
R20  42.49,17.59 90 top
R21  52.76,25.15 90 top
R22  49.54,27.47 0 top
R24  -9.72,-23.42 0 top  (outside the outline)
R25  45.84,27.59 0 top
R26  55.52,26.43 180 top
R27  35.36,20.62 90 top
R28  37.75,20.65 90 top
R29  39.83,20.6 90 top
R30  7.05,39.83 270 top
R31  12.95,37.67 90 top
R32  11.87,43.32 0 top
S1  25.22,52.15 180 top
S2  45.74,70.64 180 top
T1  46,21.25 0 top
T2  52.08,21.38 0 top
U1  18.88,35.36 90 top
U2  38.57,33.78 180 top
U3  12.09,19.31 90 top
U17  27.32,23.95 0 top
U$1  28.16,55.29 0 top
U$2  13.19,28.37 0 top
U$3  50.18,61.61 90 top
U$10  -0.75,34.18 270 top
U$11  17.72,47.7 270 bottom
U$15  [LOGO]  18.57,44.38 0 top
X1  4.94,27.54 270 top
X2  52.19,35.55 90 top
X4  4.92,19.6 270 top
X5  4.89,12.43 270 top
X6  30.62,7.83 0 top
X8  12.62,52.29 90 top

### Tracks (layer width: path | path; a pad name or v marks a point on that pad's centre or on a via)
+3V3  (via drill 0.35)  (1 unrouted)
  Top 0.203: X2.4 50.22,33.67 47.86,36.03 U2.13 v42,36.03 40.03,36.03 v40,36 v35,36 | C20.1 11.1,30.25 U$2.P$1 | C31.+ 45.97,50.16 C15.1 43.03,50.83 v42.73,51.47 IC2.2 39.01,50.83 v38.92,50.75 | U3.8 13.97,18.71 14.14,18.54 14.14,18.51 14.67,17.99 15.18,17.99 | C21.1 16.9,17.99 15.18,17.99 | U3.13 13.09,21.44 C23.1 10.98,23 v10,23 | 12.39,34.7 C19.1 | R1.2 34.46,47.58 v38.29,47.58 37.09,48.78 33.69,48.78 33.36,49.1 v14.62,49.1 | U2.32 34.82,38.18 34.87,38.13 v34.87,37.62 | C20.1 9.23,30.04 X1.5 2.07,30.04 v2.03,30 | v2.03,56 v39,56 | U3.1 11.11,17.73 11.11,16.97 11.49,16.59 | 11.49,16.59 13.78,16.59 15.18,17.99 | v10.61,26 10.61,26.65 10.82,26.86 10.82,28.46 C20.1 | v9.97,16.59 11.49,16.59 | v38.13,30.49 37.4,30.49 37.26,30.63 37.02,30.63 35.9,31.76 35.37,31.76 33.64,30.03 U2.48 | LED3.A 53.93,16.73 53.25,17.41 v51.5,17.41 49.72,17.41 49.16,16.86 LED4.A | v40.76,38.13 41.16,38.13 41.34,38.31 41.34,39.46 U2.19 | U2.64 42.32,28.87 v42.73,29.29 | 12.87,38.39 R31.2 | 11.14,39.13 R18.2 | R18.2 11.02,39.07 10.1,39.07 9.25,38.22 R19.2 | R19.2 8.85,38.22 8.06,39.01 7.07,39.01 R30.2 | 14.35,34.75 C40.1 | v10,34.55 12.28,34.55 C19.1 | C19.1 14.6,34.5 C40.1 | v10,31 10,29.27 C20.1 | v14.16,43.39 12.79,43.39 R32.2 | v2.03,37.8 v5.78,37.8 6.8,37.8 6.81,37.81 8.67,37.81 R19.2 | C40.1 14.99,34.75 | C40.1 15.39,35.16 18.73,35.16 19.51,34.38 U1.3 | R18.2 11.75,38.52 R31.2 | R31.2 14.58,38.52 C39.1
  Bottom 0.203: C5.1 38.32,37.1 C7.1 | C6.1 39.79,34.76 C4.1 38.26,34.73 C1.1 38.26,30.62 v38.13,30.49 | C6.1 39.85,32.36 C3.2 | C7.1 40,36.98 v40,36 40,34.84 C6.1 | 42.02,36.02 v42,36.03 | v38.29,47.58 38.92,48.21 v38.92,50.75 39,50.83 v39,56 | v10,31 v10,34.55 | v42.73,51.47 42.48,36.48 42.02,36.02 | v2.03,56 v2.03,37.8 v2.03,30 | v10.61,26 10.61,23.61 v10,23 10,16.62 v9.97,16.59 | X2.4 51.31,33.24 51.31,17.6 v51.5,17.41 | C7.1 39.88,37.25 v40.76,38.13 | v34.87,37.62 35,37.49 v35,36 | v42.73,29.29 42.73,35.3 42.02,36.02 | U$11.PIN4 4.52,39.45 5.14,39.45 5.78,38.81 v5.78,37.8 | v14.62,49.1 14.16,48.64 v14.16,43.39
+5V  (via drill 0.35)
  Top 0.254: IC3.2 50.02,42.52 C35.1 53.4,43.96 C36.+
  Top 0.406: 50.02,42.52 48.96,41.47 48.46,41.47 47.99,41 v46,41 | v31.43,25.86 U17.8 | v31.43,23.45 31.52,23.54 C37.2 | v44,7.73 43.9,7.83 29.65,7.83 29.25,8.23 X6.5 X6.6
  Bottom 0.406: v46,41 44,39 v44,7.73 | X6.5 31.43,11.43 v31.43,23.45 v31.43,25.86
+12V  (via drill 0.35)  (3 unrouted)
  Top 0.406: C33.1 51.02,46.46 51.05,46.46 | 51.05,46.46 C34.+ 54.7,46 | IC3.3 51.05,46.46 | v32,54 40.23,54 IC2.3 42.09,53.14 43.04,54.09 C12.+ 45.78,53.16 C14.1 49.1,52.71
  Top 1.27: v56.32,11.51 44.13,11.51 41.85,9.22 40.25,9.22 X6.1 X6.2 X6.3 | v56.32,52.53 55.7,53.16 C14.1 | v56.32,46 55.87,46.46 C34.+
  Bottom 0.406: v32,54 30.62,54 IC1.3 30.15,56.14 C32.+ 30.8,57.9 C29.1
  Bottom 1.27: 56,54 D2.K | 56,54 56.32,53.68 v56.32,52.53 v56.32,46 v56.32,11.51 | C38.+ 56.02,54.02 56,54
AGND  (via drill 0.35)
  other vias: 32.19,20.53 27.96,12.29 24.53,27.15 28.02,22.71 33.11,16.68 25.44,16.01 21.55,21.5 23.35,27.41 24.43,20.97 30.59,15.47 21.86,4.67 28.47,4.67 33.11,19.47
  pour Top (isolate 0.203): 25.84,11.76 25.46,11.38 25.46,9.1 25.34,8.97 22.16,8.97 21.4,8.21 21.4,1.48 21.53,1.6 28.77,1.6 29.02,1.86 29.02,8.97 30.54,10.49 30.54,10.87 30.54,13.41 33.72,16.59 33.72,26.11 29.4,30.43 23.18,30.43 19.75,27 18.99,26.24 18.99,23.19 23.3,18.88 23.43,18.88 23.68,18.62 23.68,14.3 25.84,12.14
  pour Bottom (isolate 0.203): 25.84,11.76 25.46,11.38 25.46,9.1 25.34,8.97 22.16,8.97 21.4,8.21 21.4,1.48 21.53,1.6 28.77,1.6 29.02,1.86 29.02,8.97 30.54,10.49 30.54,13.41 33.72,16.59 33.72,26.11 29.4,30.43 23.18,30.43 18.99,26.24 18.99,23.19 23.3,18.88 23.43,18.88 23.68,18.62 23.68,14.3 25.84,12.14
CAN_RX
  Top 0.203: U1.4 21.73,32.89 22.03,32.59 31,32.59 31.56,32.03 U2.44
CAN_TX
  Top 0.203: U1.1 17.71,32.16 17.71,31.8 17.86,31.65 21.17,31.65 21.52,32 31,32 31.47,31.53 U2.45
CANH  (via drill 0.35)
  Top 0.203: 19.23,45 R2.1 | 18.22,37.84 U1.7 18.24,39.37 v18.22,39.39 | v18.22,44.91 19.32,44.91 R2.1 | R2.1 13.94,44.89 13.9,44.84 12.29,44.84 C16.1 3.57,45.59 v3.49,45.67 | v3.49,50.5 5.08,50.5 U$10.P$4 9.26,50.68 10.22,51.64 12.15,51.64 X8.3
  Bottom 0.203: v18.22,39.39 v18.22,44.91 | v3.49,45.67 v3.49,50.5
CANL  (via drill 0.35)
  Top 0.203: v20.89,46.43 20.74,46.59 R2.2 19.34,47.1 17.97,48.47 12.37,48.47 11.61,47.71 | 19.49,37.84 U1.6 19.51,39.15 v19.75,39.39 | 11.61,47.71 C17.1 | v2.73,54.18 5.25,54.18 U$10.P$3 9.34,54.18 10.6,52.91 12.17,52.91 X8.2 | v2.73,47.96 10.6,47.96 10.85,47.71 11.61,47.71
  Bottom 0.203: v2.73,47.96 v2.73,54.18 | v19.75,39.39 20.89,40.66 v20.89,46.43
DUPA  (via drill 0.35)
  Top 0.203: S2.1 S2.4 44.64,70.78 C11.1 42.53,73.56 41.72,74.37 26.27,74.37 26.26,74.37 14.66,74.37 v14.03,73.74 | v14.03,67.52 14.26,67.29 U$1.5
  Bottom 0.203: v14.03,73.74 v14.03,67.52
GND  (via drill 0.35)  (162 unrouted)
  Top 0.203: 10.57,19.93 U3.20 10.09,19.91 10,20 10,21.19 10.48,21.67 v10.98,21.67 11.09,21.56 U3.18 | 13.89,19.93 13.7,19.93 13.61,19.93 U3.11 14.4,19.91 14.59,20.09 15.2,20.09 v16,20.89 | v14,22 12.96,23.05 C23.2 | U$2.P$2 U$2.P$3 12.09,27.7 11.29,26.9 11.29,26.09 11.44,25.94 12.94,25.94 v13.14,25.73 | C20.2 10.06,26.34 9.98,26.26 9.98,26 v9.71,25.73 | v16,17.08 16.49,17.08 C21.2 | U1.2 18.16,32.97 | C17.2 12.92,47.61 12.16,46.86 10.85,46.86 10.55,47.16 v10.02,47.16
  Top 0.254: v38.8,16.21 39.57,16.21 LED9.C
  Top 1.27: v51.5,4.02 41.24,4.02 X6.9 X6.10
  Bottom 0.203: v10.98,21.67 11.32,22 v14,22 | C7.2 41.59,36.77 40.83,36.02 40.83,35.42 C6.2
  Bottom 0.254: v38.8,16.21 38.8,8.24 X6.9
  Bottom 1.27: U$3.P$2 52.22,58.9 C38.- 54.55,52.37 54.55,10.62 51.5,7.57 v51.5,4.02
  other vias: 40,31.02 39,30 43.24,28.53 37.39,38.09 17,30 15,50 15,53 41.84,29.83 37.4,31.32 31.45,30.25 45.65,31.21 41.08,16.34 40.76,6.64 14.98,22.67 10.21,14.99 2.21,11.99 18.84,30.74 1.45,24.3 1.45,20.3 1.45,15.29 1.54,10.15 1.51,7.72 9.97,9.71 9.94,6.65 10.04,4.55 38.63,18.32 36.52,18.43 36.03,22.75 42.26,21.68 43.76,45.98 40.97,46.29 45.24,38.72 52.12,44.63 50.48,50.89 42.58,59.92 48.03,65.15 50.76,72.36 52.91,71.43 54.82,71.69 43.01,75.24 10.74,58.62 7.67,58.99 5.64,64.19 5.55,67.33 5.71,72.55 10.44,72.52 10.41,67.78 10.63,64.38 10.1,48.8 9.82,49.87 17.82,50.12 17.95,53.17 44.56,5.62 36.18,4.61 40.25,12.22 51.42,12.73 19.69,4.55 17.4,10.14 17.15,5.82 9.21,12.5 7.8,42.08 15.42,45.63 7.35,35.92 3.54,34.14 16.75,31.09 20.25,34.77 7.99,48.93 16.63,45.63 19.42,49.95 16.05,38.9 14.47,23.72 12.69,14.83 12.94,11.02 16.75,12.29 20.05,19.66 49.01,51.41 44.69,51.92 41.9,45.31 43.68,39.98 37.58,52.17 41.14,55.47 46.47,59.54 45.45,61.06 44.44,61.06 40.12,59.79 44.18,65.38 40.63,67.41 25.01,47.16 24.25,48.17 23.23,49.95 31.29,47.16 32.31,50.97 33.07,52.49 31.8,52.74 18.47,34.52 15.8,36.55
  pour Top (isolate 0.203): 20.38,1.6 20.26,1.73 -1.46,1.73 -1.46,79.07 1.08,81.61 56.7,81.61 60.39,77.93 60.39,2.87 58.48,0.97 36.89,0.97 35.62,2.24 35.62,8.33 36.64,9.35 36.64,11.13 38.67,13.16 55.69,13.16 56.2,13.67 56.2,31.96 56.32,32.08 50.86,32.08 49.21,30.43 49.21,29.04 49.34,28.91 44.13,28.91 43.62,28.4 42.99,27.77 42.99,16.08 42.73,15.83 34.73,15.83 34.48,16.08 34.48,26.5 34.1,26.88 29.78,31.19 29.78,31.32 22.92,31.32 22.54,31.32 18.35,27.13 18.35,22.56 21.27,19.64 22.92,17.99 22.92,17.86 22.92,13.79 24.95,11.76 24.95,10.24 24.57,9.86 21.02,9.86 20.38,9.22
  pour Bottom (isolate 0.203): 20.38,1.6 20.26,1.73 -1.46,1.73 -1.46,79.07 1.08,81.61 56.7,81.61 60.39,77.93 60.39,2.87 58.48,0.97 36.89,0.97 35.62,2.24 35.62,8.33 36.64,9.35 36.64,11.13 38.67,13.16 55.69,13.16 56.2,13.67 56.2,31.96 56.32,32.08 50.86,32.08 49.21,30.43 49.21,29.04 49.34,28.91 44.13,28.91 42.99,27.77 42.99,16.08 42.73,15.83 34.73,15.83 34.48,16.08 34.48,26.5 29.78,31.19 29.78,31.32 22.54,31.32 18.35,27.13 18.35,22.56 22.92,17.99 22.92,13.79 24.95,11.76 24.95,10.24 24.57,9.86 21.02,9.86 20.38,9.22
GND1  (via drill 0.35)  (15 unrouted)
  Top 0.152: v45.55,15.55 43.73,15.55 43.37,15.19 41.85,15.19 40.83,14.18 40.58,14.18
  other vias: 47.18,22.68 44.76,22.02 49.42,26.38 53.31,22.3 52.31,15.3 51.31,15.3 50.64,23.18 35.55,12.76 33.77,4.63
  pour Top (isolate 0.203): 29.65,6.81 29.65,1.98 34.73,1.98 34.99,2.24 34.99,8.84 34.86,8.97 36.13,10.24 36.13,12.91 36.64,13.41 37.02,13.79 54.93,13.79 55.18,14.05 55.18,31.32 50.99,31.32 49.97,30.3 49.97,28.78 49.47,28.27 44.26,28.27 44.01,28.02 44.01,15.32 43.37,14.68 34.61,14.68 31.18,11.26 31.18,9.22 29.65,7.7
  pour Bottom (isolate 0.203): 29.65,7.7 29.65,1.98 34.73,1.98 34.99,2.24 34.99,8.84 34.86,8.97 36.13,10.24 36.13,12.91 37.02,13.79 54.93,13.79 55.18,14.05 55.18,31.32 50.99,31.32 49.97,30.3 49.97,28.78 49.47,28.27 44.26,28.27 44.01,28.02 44.01,15.32 43.37,14.68 34.61,14.68 31.18,11.26 31.18,9.22
IGN_TEST  (via drill 0.35)
  Top 0.203: R5.1 46.38,21.98 T1.C 44.99,23.37 43.86,23.37 43.65,23.57 v37.02,23.57 | v37,30 36.82,29.82 U2.53
  Bottom 0.203: v37.02,23.57 37,23.59 v37,30
IGNITION  (via drill 0.35)
  Top 0.203: R25.1 44.91,27.51 v43.12,27.51 | v43,24.21 36.71,24.21 36.15,23.64 35.19,23.64 v34.73,23.19 | v34.99,35.09 34.55,35.53 U2.37
  Bottom 0.203: v43.12,27.51 43.12,24.32 v43,24.21 | v34.73,23.19 34.73,33.69 34.78,33.74 34.78,34.88 v34.99,35.09
KEY_IN  (via drill 0.35)
  Top 0.406: 48.4,14 v48.32,14.18 49.85,14.18 50.37,14.7 R12.1
  Top 1.27: v30.92,1.98 v42.35,1.98 | v42.35,14.18 v48.32,14.18 | v48.32,23.45 49.21,23.45 Q2.3
  Bottom 1.27: X6.12 30.62,2.29 v30.92,1.98 | v42.35,1.98 v42.35,14.18 | v48.32,14.18 48.32,22.18 48.35,22.2 48.35,23.17 48.32,23.19 v48.32,23.45
KEY_OUT  (via drill 0.35)
  Top 0.406: v32.45,14.94 32.96,15.45 41.34,15.45 41.77,15.88 43.19,15.88 44.08,16.77 R3.1
  Bottom 0.406: X6.4 32.45,9.7 v32.45,14.94
  Bottom 1.27: X6.4 32,9.04 33.46,7.57 33.46,6.5 X6.11
KEY_TEST  (via drill 0.35)
  Top 0.203: 52.38,22.78 T2.C 52.08,23.61 R21.1 51.81,24.88 42.77,24.88 42.49,24.59 v35.75,24.59 | v36.09,30.3 35.82,30.02 U2.51
  Bottom 0.203: v35.75,24.59 36.09,24.93 v36.09,30.3
MPU_CS  (via drill 0.35)
  Top 0.203: U3.22 9.89,19.11 v9,20 | 14.16,40.5 13.78,40.5 | 14.16,40.5 27.65,40.44 v27.75,40.34 | v27.75,37.67 29.53,37.67 29.65,37.54 32.85,37.54 U2.33 | v10.64,40.55 10.7,40.5 14.16,40.5
  Bottom 0.203: v27.75,37.67 v27.75,40.34 | 9.18,40.24 9,40.07 | 9.18,40.24 9.48,40.55 v10.64,40.55 | v9,20 9,40.07 | 9,40.07 9.18,40.24
MPU_INT  (via drill 0.35)
  Top 0.203: v17,24 31.09,24 31.43,24.34 33.34,24.34 34.48,25.48 38.92,25.48 39.32,25.87 U2.58 | v15,21 14.45,20.45 14.44,20.45 14.3,20.31 13.91,20.31 | 13.91,20.31 13.85,20.31 | U3.12 13.91,20.31
  Bottom 0.203: v15,21 17,23 v17,24
MPU_MISO  (via drill 0.35)
  Top 0.203: U3.9 v15,19.11 16.11,19.11 17,20 v19,20 | v20,30 21,31 v28,31 | v28.59,36 29.12,36.53 U2.35 | X5.2 12.29,11.8 13.02,12.53 v15.05,12.53
  Bottom 0.203: v19,20 20,21 v20,30 | v28,31 28.59,31.59 v28.59,36 | v15.05,12.53 15.05,19.06 v15,19.11
MPU_MOSI  (via drill 0.35)
  Top 0.203: U3.24 7.74,18.31 v7.05,19 | v9.27,41.87 v30.29,41.87 | X5.3 5.83,13.54 6.16,13.54 7.62,15 v9,15 | v30.25,35.89 30.79,35.89 30.92,36.02 32.86,36.02 U2.36 | v7.05,31.7 6.79,31.96 v2.73,31.96 | v2.73,43.64 v9.27,43.64
  Bottom 0.203: v30.29,41.87 v30.25,35.89 | v9,15 8.63,15.37 8.63,16.54 7.05,18.12 v7.05,19 v7.05,31.7 | v2.73,31.96 v2.73,43.64 | 8,43.64 v9.27,43.64 v9.27,41.87
MPU_SCLK  (via drill 0.35)
  Top 0.203: U3.23 8.74,18.71 v8.06,19.38 | v28.48,37 30.03,37.03 U2.34 | X5.4 2.99,14.3 v2.35,14.94 | v2.75,30.98 v8.06,30.98 | v10,41.19 v28.48,41.19
  Bottom 0.203: v8.06,19.38 v8.06,30.98 8.06,40.02 9.23,41.19 v10,41.19 | v28.48,41.19 v28.48,37 | v2.35,14.94 2.35,29.42 | 2.35,29.42 2.35,29.43 | 2.35,29.42 2.75,29.81 v2.75,30.98
MS56_CS  (via drill 0.35)
  Top 0.203: U$2.P$4 U$2.P$5 21.02,26.5 v22.54,28.02 | 40.83,39.49 U2.20 40.82,40.83 v41.08,41.1 | v22.62,44.6 40.39,44.6 v41.09,43.9
  Bottom 0.203: v22.62,44.6 22.54,44.52 v22.54,28.02 | v41.09,43.9 41.09,41.11 v41.08,41.1
MS56_MISO  (via drill 0.35)
  Top 0.203: U$2.P$6 v17,27.75 20.66,27.75 v21.91,29 | X4.3 5.86,20.71 6.18,20.71 9.84,24.37 16.26,24.37 16.8,24.91 v16.95,24.91 | v39.56,46.31 39.36,46.51 v22.47,46.51 | U2.22 39.82,40.59 39.56,40.85 v39.56,42.37
  Bottom 0.203: v22.47,46.51 21.91,45.94 v21.91,29 | v16.95,24.91 17,24.95 v17,27.75 | v39.56,46.31 v39.56,42.37
MS56_MOSI  (via drill 0.35)
  Top 0.203: U$2.P$7 v18,29 21.01,29 22.07,30.05 28.13,30.05 v29.27,31.19 | v30,45.88 37.96,45.88 v38.42,45.42 | v8,14.05 v17.22,14.05 | v38.81,41.35 38.81,40.85 38.8,40.85 39.31,40.34 39.31,39.49 U2.23
  Bottom 0.203: v29.27,31.19 29.27,45.15 v30,45.88 | X4.2 5.86,18.48 6.18,18.48 8,16.66 v8,14.05 | v17.22,14.05 18,14.83 v18,29 | v38.42,45.42 38.81,45.03 v38.81,41.35
MS56_SCLK  (via drill 0.35)
  Top 0.203: U$2.P$8 15.24,30.25 v16,30.24 | v15.59,43.77 39.94,43.77 v40.32,43.39 U2.21 | X4.4 8.89,25 v16,25
  Bottom 0.203: v16,25 v16,30.24 14.67,31.57 14.67,42.62 | v15.59,43.77 15.56,43.77 14.67,42.88 14.67,42.62 | 14.67,31.32 14.67,42.62
N$1
  Top 0.203: U3.10 13.62,19.53 14.53,19.53 14.74,19.74 16.04,19.74 C22.1 17.19,21.19
N$2  (via drill 0.35)  (1 unrouted)
  Top 0.152: U2.30 35.81,40.59 v35.56,40.85
  Bottom 0.152: v35.56,40.85 34.99,41.42 v34.99,42.37
N$3  (via drill 0.35)
  Top 0.203: R9.2 v25.46,18.45 C26.2 | C25.1 v25.46,20.27 23.73,20.27 v23,21 | v22.92,26.5 24.22,26.5 U17.1
  Bottom 0.203: v23,21 23,26.42 v22.92,26.5 | v25.46,18.45 v25.46,20.27
N$4  (via drill 0.35)
  Top 0.203: 28.9,18.88 R8.2 v30.54,18.45 C27.1 | U17.4 25.88,21.03 28.15,21.03 C25.2 v30.42,20.27
  Bottom 0.203: v30.54,18.45 30.54,20.14 v30.42,20.27
N$5
  Top 0.203: R4.2 R3.2 45.05,18.65 T1.B
N$6  (via drill 0.35)
  Top 0.203: U2.1 42.69,30.03 v41.72,31
  Bottom 0.203: C3.1 41.72,32.19 v41.72,31
N$7
  Top 0.203: R14.1 45.2,66.97 LED1.A
N$8  (via drill 0.35)
  Top 0.203: 44.3,32 U2.5 45.97,32.02 47.18,33.23 v48.2,33.23
  Bottom 0.203: C8.2 46.13,30.44 46.9,31.22 | 46.9,31.22 47.02,31.33 | 46.9,31.22 46.9,31.45 Q1.3 47.45,31.46 48.2,32.21 v48.2,33.23
N$9  (via drill 0.35)
  Top 0.203: U2.6 45.81,32.53 46.42,33.14 46.42,33.48 46.94,34 v49,34
  Bottom 0.203: C9.2 48.98,36.18 Q1.1 49.29,34.29 v49,34
N$10
  Top 0.203: R10.1 24.54,23 U17.3
N$11
  Top 0.203: R15.2 LED2.A
N$12
  Top 0.203: T2.B 50.37,19.52 R12.2 50.43,18.3 R13.2
N$13  (via drill 0.35)
  Top 0.203: R6.2 22.08,16.67 22.01,16.61 21.53,16.12 v21.53,15.45 | X6.7 23.77,10.67 23.56,10.87 v21.53,10.87
  Bottom 0.203: v21.53,10.87 v21.53,15.45
N$14  (via drill 0.35)
  Top 0.203: 19.73,16.74 19.62,16.63 | 19.73,16.74 R7.2 | X6.8 19.72,9.25 v19.62,9.35 | v19.62,15.45 19.62,16.63 | 19.62,16.63 19.73,16.74
  Bottom 0.203: 19.49,15.32 v19.62,15.45 v19.62,9.35
N$15
  Top 0.203: R10.2 24.54,24.91 U17.2
N$16  (via drill 0.35)
  Top 0.203: U17.7 30.2,25 v33,25 | v32.96,27.38 32.79,27.55 R11.1
  Bottom 0.203: v33,25 32.96,25.04 v32.96,27.38
N$17
  Bottom 1.27: U$3.P$1 54.74,61.8 D2.A
N$18
  Top 0.203: U$1.6 39.03,65.29 39.71,65.97 42.41,65.97 R14.2
N$19
  Top 0.203: R15.1 41.63,65.29 U$1.15
N$20
  Top 0.203: LED4.C 49.17,18.82 R5.2
N$21
  Top 0.203: R21.2 54.42,24.34 LED3.C
N$26  (via drill 3.1)  (2 unrouted)
  other vias: 4,3.5 55,75 4,75
N$27  (via drill 3.1)
  other vias: 55,3.5
N$28
  Top 0.254: R1.1 LED6.A
N$29  (via drill 0.35)
  Top 0.203: R20.2 41.59,19.34 v41.59,19.51 | U2.60 40.32,29.03 v40.83,29.54
  Bottom 0.203: v41.59,19.51 41.59,28.78 v40.83,29.54
N$30  (via drill 0.35)
  Top 0.203: R27.2 36.06,21.47 37.27,22.68 37.42,22.68 v37.53,22.8 | v37.66,26.75 37.82,26.91 U2.55
  Bottom 0.203: v37.65,26.75 v37.66,26.75 37.66,22.92 v37.53,22.8
N$31  (1 unrouted)
  Top 0.203: Q2.1 R22.2
N$33  (via drill 0.35)
  Top 0.203: R28.2 37.75,21.88 v38.44,22.56 | U2.57 38.82,26.39 v38.54,26.11
  Bottom 0.203: v38.44,22.56 38.44,26.01 v38.54,26.11
N$34  (via drill 0.35)
  Top 0.203: 39.82,21.59 R29.2 39.56,21.72 v39.56,22.81 | v39.81,25.35 U2.59
  Bottom 0.203: v39.56,22.81 39.56,25.1 v39.81,25.35
N$35  (via drill 0.35)  (2 unrouted)
  Top 0.203: 45.19,26.5 46.42,26.5 46.7,26.79 46.7,27.61 R25.2 48.26,29.16 51.75,29.16 52.33,28.59 | 46.97,25.75 R22.1 48.69,27.62 v49.59,28.53 | v49.59,29.92 51.31,29.92 51.33,29.91 51.63,29.91 51.65,29.92 52.94,29.92
  Bottom 0.203: v49.59,28.53 v49.59,29.92
N$36
  Top 0.203: R27.1 35.31,19.71 LED7.A
N$37
  Top 0.203: R28.1 37.64,19.69 LED8.A
N$38
  Top 0.203: R29.1 39.98,19.73 LED9.A
N$42  (via drill 0.35)
  Top 0.203: R17.2 6.03,32.97 v5.02,33.99
  Bottom 0.203: U$11.DETECT 6.07,33.99 v5.02,33.99
NRST  (via drill 0.35)
  Top 0.203: v48,61 47.03,61.97 v20.51,61.97 20.05,62.44 14.16,62.44 13.65,62.94 v1.71,62.94 | v45.74,33.35 45.41,33.03 U2.7 | C10.1 28.87,51.35 S1.1 S1.4 21.05,51.35 v20.51,51.9 | X1.2 2.3,26.29 v1.65,26.94
  Bottom 0.203: v48,61 48,40 45.94,37.94 45.94,35 45.74,34.8 v45.74,33.35 | v20.51,51.9 v20.51,61.97 | v1.65,26.94 1.65,29.48 1.39,29.74 1.39,60.66 | 1.39,60.66 1.39,60.85 | 1.39,60.66 1.39,62.62 v1.71,62.94
SD_DETECT
  Top 0.203: R17.1 10.35,32.97 8.68,34.64 C24.1 9.45,35.51 24.07,35.51 24.45,35.13 28.13,35.13 28.23,35.03 U2.38
SDIO_CK  (via drill 0.35)
  Top 0.203: U2.28 36.82,40.78 v36.69,40.91 | v36.51,45.23 25.91,45.23 25.63,44.95 23.16,44.95 22.88,45.23 21.09,45.23 19.99,44.13 18.11,44.13 17.84,44.4 v3.49,44.4
  Bottom 0.203: v36.69,40.91 36.69,45.06 v36.51,45.23 | v3.49,44.4 3.49,38.81 3.75,38.56 4.31,38.56 U$11.PIN5
SDIO_CMD  (via drill 0.35)
  Top 0.203: v27.37,26.5 36.49,26.5 37.32,27.32 U2.54 | v5.65,40.59 6.33,39.92 R19.1 13.31,39.92 13.65,39.58 17.46,39.58 17.97,40.08 24.83,40.08 25.29,39.62 v26.99,39.62
  Bottom 0.203: 27.37,30.74 | 27.37,30.74 v27.37,26.5 | v5.65,40.59 4.48,40.59 U$11.PIN3 | 27.37,30.74 27.37,37.16 27.12,37.41 26.99,37.54 26.99,37.55 v26.99,39.62
SDIO_D0  (via drill 0.35)
  Top 0.203: U2.39 31.15,34.53 31.06,34.62 v23.88,34.62 | v5.78,36.27 6.96,37.46 R18.1 11.26,37.61 16.06,37.61 16.44,37.23 16.44,36.72 16.64,36.52 v23.81,36.52
  Bottom 0.203: v5.78,36.27 U$11.PIN7 | v23.81,36.52 23.81,34.69 v23.88,34.62
SDIO_D1  (via drill 0.35)
  Top 0.203: v37.78,43.13 v26.23,43.13 | v37.91,41.73 37.91,40.97 37.78,40.85 37.78,39.52 U2.26 | 7.17,36.66 7.21,36.69 | 7.17,36.66 v5.71,35.19 | v26.23,35.89 16.08,35.89 16.07,35.89 13.88,35.89 R31.1 | 13.14,36.69 R31.1 | R31.1 12.79,36.66 7.17,36.66
  Bottom 0.203: v37.78,43.13 37.91,43.01 v37.91,41.73 | v5.71,35.19 4.4,35.19 U$11.PIN8 | v26.23,35.89 v26.23,43.13
SDIO_D2  (via drill 0.35)
  Top 0.152: v31.26,41.62 31.27,41.61 36.96,41.61 37.32,41.25 U2.27
  Top 0.203: v30.8,33.99 v25,33.99 | v24.57,42.51 24.44,42.37 11.37,42.37 11.02,42.71 R32.1 10.52,42.81 v5.91,42.81
  Bottom 0.203: v30.8,33.99 31.32,34.52 v31.26,41.62 | v25,33.99 24.57,34.42 v24.57,42.51 | v5.91,42.81 4.46,42.81 U$11.PIN1
SDIO_D3  (via drill 0.35)
  Top 0.203: v23.43,28.4 33.24,28.4 34.56,27.08 36.07,27.08 36.32,27.32 U2.52 | R30.1 7.05,41.29 v6.54,41.8 | v7.05,46.43 17.46,46.43 18.22,45.67 v23.56,45.67
  Bottom 0.203: v23.43,28.4 23.17,28.66 23.17,36.27 23.18,36.28 23.18,44.15 23.56,44.53 v23.56,45.67 | U$11.PIN2 4.4,41.8 v6.54,41.8 6.54,45.93 v7.05,46.43
SERVO2_PWM  (via drill 0.35)
  Top 0.203: 38.41,20.55 38.44,20.53 | 38.54,20.53 38.44,20.53 | 38.54,20.53 v40.96,20.53 | R6.1 23.22,19.52 30.56,19.52 30.93,19.89 32.46,19.89 33.11,20.55 38.41,20.55 | v40.96,26.5 40.82,26.64 U2.61 | 38.41,20.55 38.44,20.53 | 38.44,20.53 38.54,20.53
  Bottom 0.203: v40.96,20.53 v40.96,26.5
SERVO3_PWM  (via drill 0.35)
  Top 0.203: R7.1 20.75,18.45 21.56,17.65 34.7,17.65 34.89,17.46 40.48,17.46 40.7,17.68 43.15,17.68 43.3,17.83 43.3,19.04 43,19.34 v43,20 | v42.22,26.8 41.95,27.08 41.56,27.08 41.32,27.32 U2.62
  Bottom 0.203: v43,20 43,23.31 42.37,23.94 42.37,26.66 v42.22,26.8
SWCLK  (via drill 0.35)
  Top 0.203: v33.97,13.41 8.06,13.41 v7.43,12.78 | v3.11,27.51 5.36,27.51 X1.3 | v3,8.62 7.14,8.62 v7.17,8.59 | 34.1,29.04 v34.1,28.75 34.1,29.09 34.43,29.42 34.67,29.42 34.82,29.27 U2.49
  Bottom 0.203: v34.1,28.75 34.1,13.54 v33.97,13.41 | v7.43,12.78 7.43,8.84 v7.17,8.59 | v3,8.62 3,27.16 v3.11,27.51
SWDIO  (via drill 0.35)
  Top 0.203: v3.86,15.95 16.21,15.95 17.6,14.56 29.14,14.56 v29.65,14.56 | v30,30.51 30.52,31.03 U2.46
  Bottom 0.203: 4,16.1 v3.86,15.95 3.86,27.58 4.58,28.3 4.9,28.3 X1.4 | v30,30.51 29.65,30.16 v29.65,14.56
TENSO_ADC  (via drill 0.35)
  Top 0.203: C28.1 R11.2 31.52,29.25 31.69,29.42 33.92,29.42 v35.64,31.13 | 44.22,33.48 U2.8 35.67,33.53 v35.62,33.48
  Bottom 0.203: v35.64,31.13 35.62,31.14 v35.62,33.48
TENSO_IN+  (via drill 0.35)
  Top 0.203: v27.37,15.19 28.89,15.19 29.15,15.45 29.15,16.58 R8.1
  Bottom 0.203: X6.14 25.14,12.96 v27.37,15.19
TENSO_IN-  (via drill 0.35)
  Top 0.203: v22.67,15.32 26.23,15.32 26.65,15.75 R9.1
  Bottom 0.203: X6.15 22.39,14.79 v22.67,15.32
UART_RX
  Top 0.203: X2.2 49.57,36.17 47.69,38.05 42.61,38.05 42.35,38.31 42.35,39.44 U2.17
UART_TX
  Top 0.203: U2.16 47.47,37.53 50,35 51.66,35 X2.3
XBEE_RX  (via drill 0.35)
  Top 0.203: v21.28,34.62 22.66,34.62 23.93,33.36 31.28,33.36 32.11,32.53 U2.43 | v21,73 20.71,73.29 U$1.2
  Bottom 0.203: v21.28,34.62 21.28,45.93 21.52,46.17 21.52,72.48 v21,73
XBEE_TX  (via drill 0.35)
  Top 0.203: v34.15,34 33.87,33.72 33.87,33.28 33.63,33.03 U2.42 | v33.72,71.33 15.69,71.33 U$1.3
  Bottom 0.203: v34.15,34 34.15,56.28 34,56.44 34,71.05 v33.72,71.33
XBEE_VDD  (via drill 0.35)
  Top 0.254: v26,75 15.95,75 U$1.1
  Bottom 0.254: IC1.2 27.84,57.12 C30.1 28.05,60.3 C13.+ 27.84,73.17 v26,75

### Text on the board
tPlace: Barduś | Hybrid lower pcb vol2